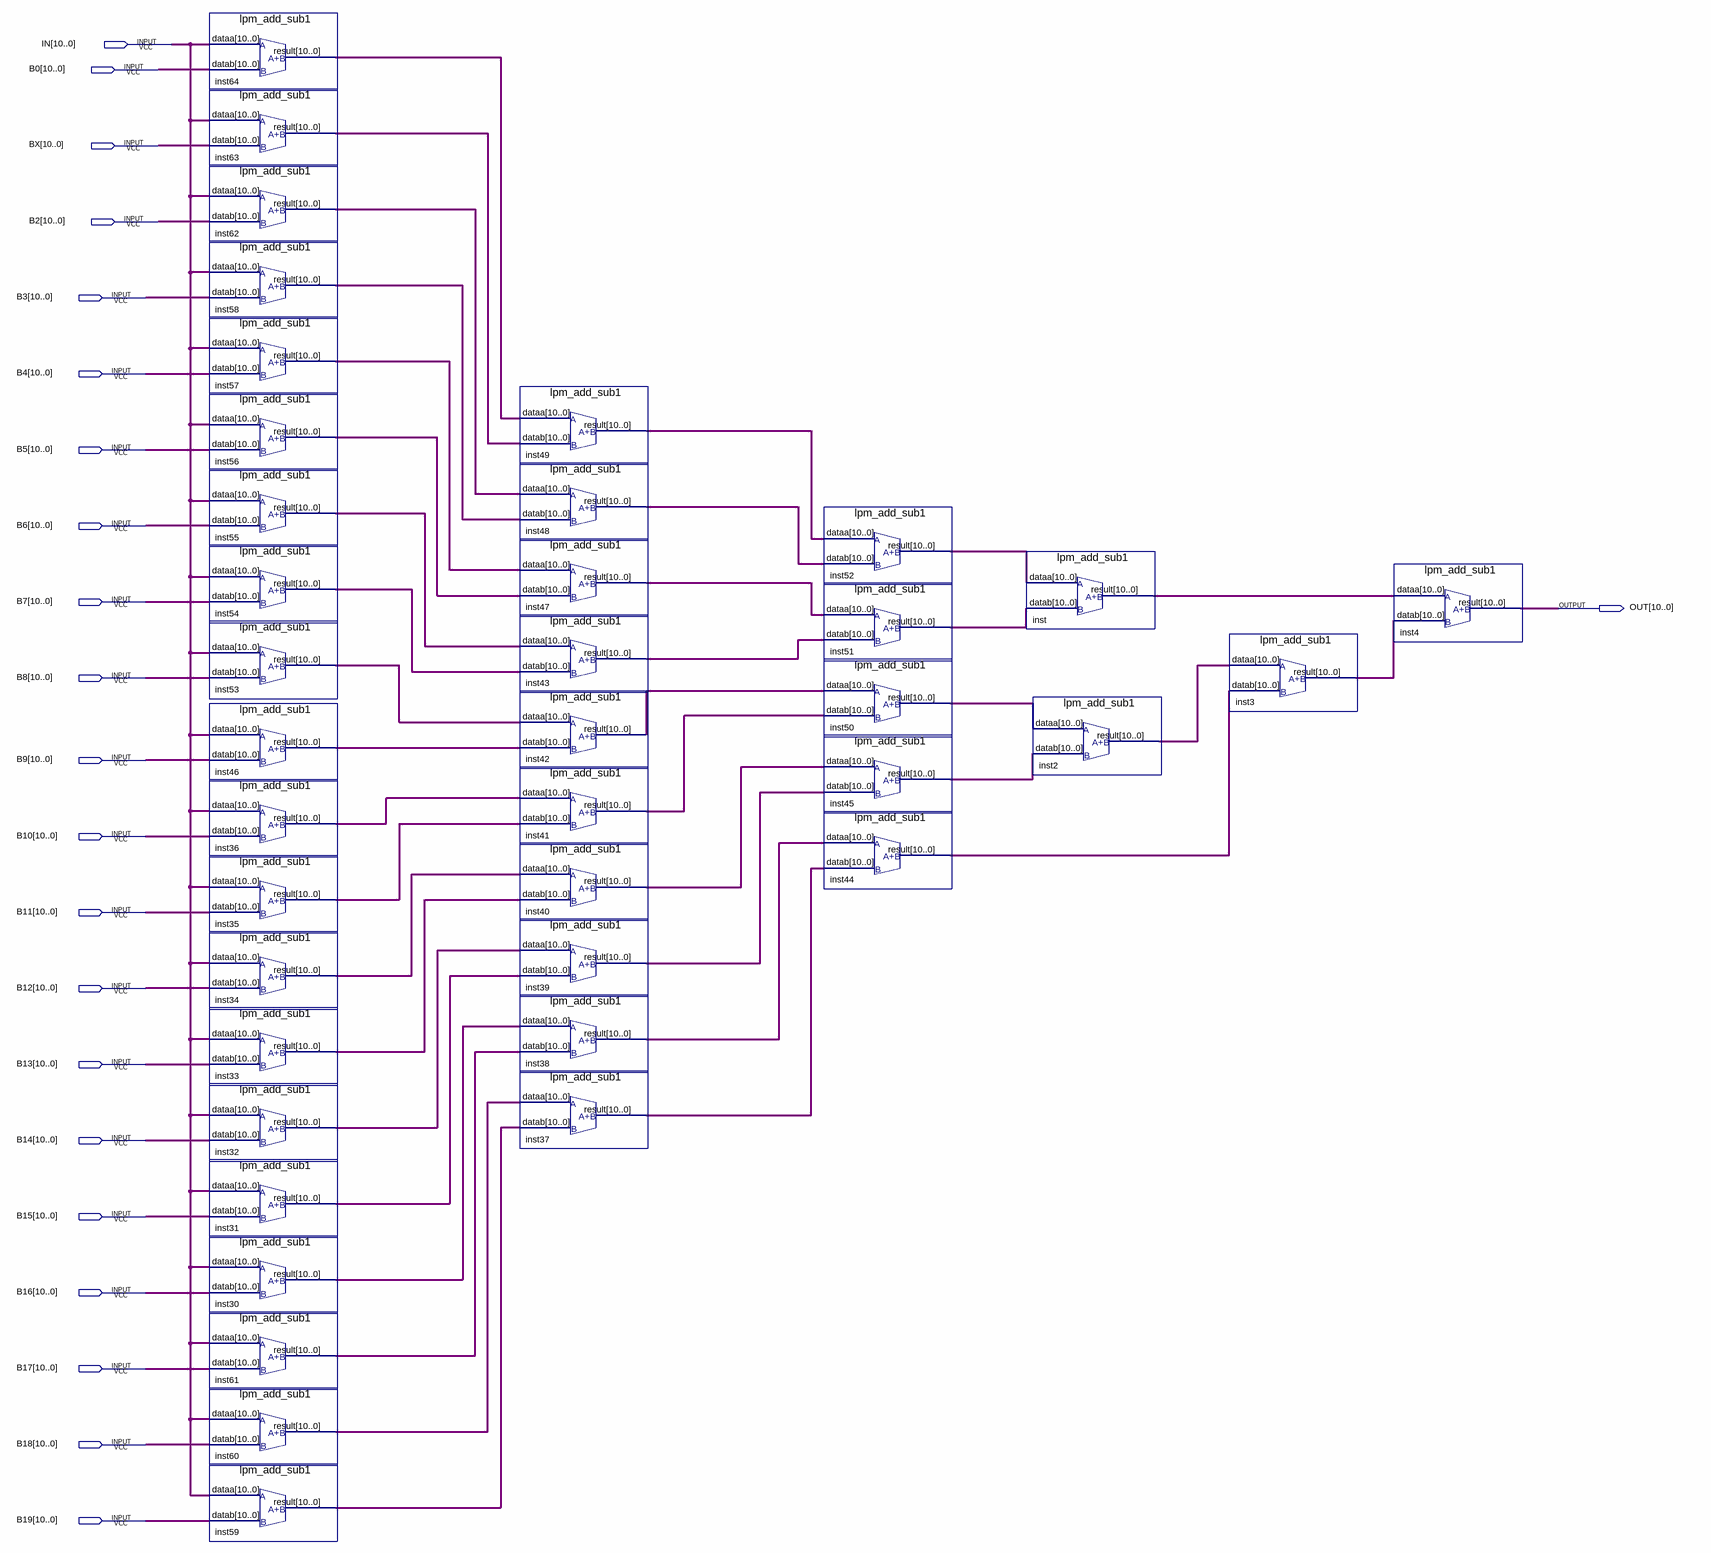
[diagram p0: schematic sheet]
// Quartus schematic ADDALL1.bdf as structural Verilog: 39 symbols, 22 pins
module ADDALL1 (
  input  [10:0] IN,
  input  [10:0] B0,
  input  [10:0] BX,
  input  [10:0] B2,
  input  [10:0] B3,
  input  [10:0] B4,
  input  [10:0] B5,
  input  [10:0] B6,
  input  [10:0] B7,
  input  [10:0] B8,
  input  [10:0] B9,
  input  [10:0] B10,
  input  [10:0] B11,
  input  [10:0] B12,
  input  [10:0] B13,
  input  [10:0] B14,
  input  [10:0] B15,
  input  [10:0] B16,
  input  [10:0] B17,
  input  [10:0] B18,
  input  [10:0] B19,
  output [10:0] OUT
);

  wire [10:0] inst2_result, inst3_result, inst30_result, inst31_result, inst32_result, inst33_result,
       inst34_result, inst35_result, inst36_result, inst37_result, inst38_result, inst39_result,
       inst40_result, inst41_result, inst42_result, inst43_result, inst44_result, inst45_result,
       inst46_result, inst47_result, inst48_result, inst49_result, inst50_result, inst51_result,
       inst52_result, inst53_result, inst54_result, inst55_result, inst56_result, inst57_result,
       inst58_result, inst59_result, inst60_result, inst61_result, inst62_result, inst63_result,
       inst64_result, inst_result;

  lpm_add_sub1 inst64 (.dataa(IN), .datab(B0), .result(inst64_result));
  lpm_add_sub1 inst63 (.dataa(IN), .datab(BX), .result(inst63_result));
  lpm_add_sub1 inst62 (.dataa(IN), .datab(B2), .result(inst62_result));
  lpm_add_sub1 inst58 (.dataa(IN), .datab(B3), .result(inst58_result));
  lpm_add_sub1 inst57 (.dataa(IN), .datab(B4), .result(inst57_result));
  lpm_add_sub1 inst56 (.dataa(IN), .datab(B5), .result(inst56_result));
  lpm_add_sub1 inst55 (.dataa(IN), .datab(B6), .result(inst55_result));
  lpm_add_sub1 inst54 (.dataa(IN), .datab(B7), .result(inst54_result));
  lpm_add_sub1 inst53 (.dataa(IN), .datab(B8), .result(inst53_result));
  lpm_add_sub1 inst46 (.dataa(IN), .datab(B9), .result(inst46_result));
  lpm_add_sub1 inst36 (.dataa(IN), .datab(B10), .result(inst36_result));
  lpm_add_sub1 inst35 (.dataa(IN), .datab(B11), .result(inst35_result));
  lpm_add_sub1 inst34 (.dataa(IN), .datab(B12), .result(inst34_result));
  lpm_add_sub1 inst33 (.dataa(IN), .datab(B13), .result(inst33_result));
  lpm_add_sub1 inst32 (.dataa(IN), .datab(B14), .result(inst32_result));
  lpm_add_sub1 inst31 (.dataa(IN), .datab(B15), .result(inst31_result));
  lpm_add_sub1 inst30 (.dataa(IN), .datab(B16), .result(inst30_result));
  lpm_add_sub1 inst61 (.dataa(IN), .datab(B17), .result(inst61_result));
  lpm_add_sub1 inst60 (.dataa(IN), .datab(B18), .result(inst60_result));
  lpm_add_sub1 inst59 (.dataa(IN), .datab(B19), .result(inst59_result));
  lpm_add_sub1 inst49 (.dataa(inst64_result), .datab(inst63_result), .result(inst49_result));
  lpm_add_sub1 inst48 (.dataa(inst62_result), .datab(inst58_result), .result(inst48_result));
  lpm_add_sub1 inst47 (.dataa(inst57_result), .datab(inst56_result), .result(inst47_result));
  lpm_add_sub1 inst43 (.dataa(inst55_result), .datab(inst54_result), .result(inst43_result));
  lpm_add_sub1 inst42 (.dataa(inst53_result), .datab(inst46_result), .result(inst42_result));
  lpm_add_sub1 inst41 (.dataa(inst36_result), .datab(inst35_result), .result(inst41_result));
  lpm_add_sub1 inst40 (.dataa(inst34_result), .datab(inst33_result), .result(inst40_result));
  lpm_add_sub1 inst39 (.dataa(inst32_result), .datab(inst31_result), .result(inst39_result));
  lpm_add_sub1 inst38 (.dataa(inst30_result), .datab(inst61_result), .result(inst38_result));
  lpm_add_sub1 inst37 (.dataa(inst60_result), .datab(inst59_result), .result(inst37_result));
  lpm_add_sub1 inst52 (.dataa(inst49_result), .datab(inst48_result), .result(inst52_result));
  lpm_add_sub1 inst51 (.dataa(inst47_result), .datab(inst43_result), .result(inst51_result));
  lpm_add_sub1 inst50 (.dataa(inst42_result), .datab(inst41_result), .result(inst50_result));
  lpm_add_sub1 inst45 (.dataa(inst40_result), .datab(inst39_result), .result(inst45_result));
  lpm_add_sub1 inst44 (.dataa(inst38_result), .datab(inst37_result), .result(inst44_result));
  lpm_add_sub1 inst (.dataa(inst52_result), .datab(inst51_result), .result(inst_result));
  lpm_add_sub1 inst2 (.dataa(inst50_result), .datab(inst45_result), .result(inst2_result));
  lpm_add_sub1 inst3 (.dataa(inst2_result), .datab(inst44_result), .result(inst3_result));
  lpm_add_sub1 inst4 (.dataa(inst_result), .datab(inst3_result), .result(OUT));
endmodule
